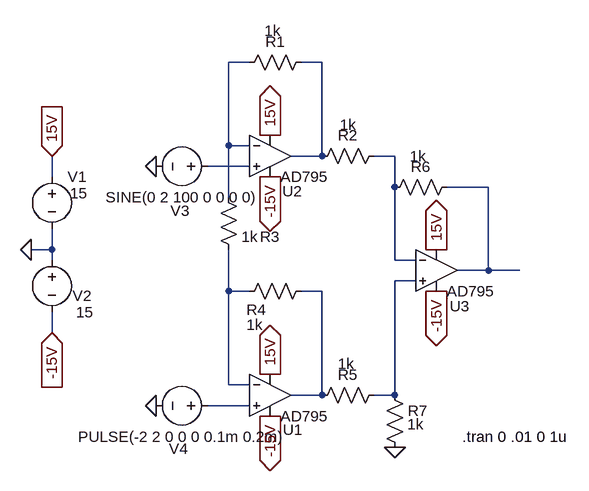
[diagram p0: schematic High Impedance Differential Amplifier.asc]
High Impedance Differential Amplifier.asc, the LTspice schematic file:
Version 4
SHEET 1 2604 1992
WIRE 160 -144 128 -144
WIRE 272 -144 240 -144
WIRE 128 -16 128 -144
WIRE 160 -16 128 -16
WIRE 272 0 272 -144
WIRE 272 0 224 0
WIRE 384 0 352 0
WIRE 160 16 96 16
WIRE -144 32 -144 0
WIRE 384 48 384 0
WIRE 528 48 464 48
WIRE 128 64 128 -16
WIRE -144 144 -144 112
WIRE -144 144 -176 144
WIRE -144 160 -144 144
WIRE 384 160 384 48
WIRE 416 160 384 160
WIRE 528 176 528 48
WIRE 528 176 480 176
WIRE 576 176 528 176
WIRE 416 192 384 192
WIRE 128 208 128 144
WIRE 160 208 128 208
WIRE 272 208 240 208
WIRE -144 272 -144 240
WIRE 128 352 128 208
WIRE 160 352 128 352
WIRE 272 368 272 208
WIRE 272 368 224 368
WIRE 384 368 384 192
WIRE 384 368 352 368
WIRE 160 384 96 384
FLAG -144 272 -15V
IOPIN -144 272 In
FLAG -176 144 0
FLAG -144 0 15V
IOPIN -144 0 In
FLAG 192 336 15V
IOPIN 192 336 Out
FLAG 192 400 -15V
IOPIN 192 400 Out
FLAG 192 -32 15V
IOPIN 192 -32 Out
FLAG 192 32 -15V
IOPIN 192 32 Out
FLAG 448 144 15V
IOPIN 448 144 Out
FLAG 448 208 -15V
IOPIN 448 208 Out
FLAG 384 448 0
FLAG 16 16 0
FLAG 16 384 0
SYMBOL Opamps\\AD795 192 304 R0
WINDOW 0 20 117 Left 2
SYMATTR InstName U1
SYMBOL voltage -144 16 R0
WINDOW 3 28 41 Left 2
WINDOW 123 0 0 Left 2
WINDOW 39 0 0 Left 2
SYMATTR InstName V1
SYMATTR Value 15
SYMBOL voltage -144 144 R0
WINDOW 0 32 71 Left 2
WINDOW 3 37 96 Left 2
WINDOW 123 0 0 Left 2
WINDOW 39 0 0 Left 2
SYMATTR InstName V2
SYMATTR Value 15
SYMBOL res 256 192 R90
WINDOW 0 60 85 VBottom 2
WINDOW 3 52 88 VTop 2
SYMATTR InstName R4
SYMATTR Value 1k
SYMBOL Opamps\\AD795 192 -64 R0
WINDOW 0 19 118 Left 2
SYMATTR InstName U2
SYMBOL res 256 -160 R90
WINDOW 0 0 56 VBottom 2
WINDOW 3 -48 60 VTop 2
SYMATTR InstName R1
SYMATTR Value 1k
SYMBOL res 112 48 R0
WINDOW 0 64 76 Left 2
SYMATTR InstName R3
SYMATTR Value 1k
SYMBOL res 368 -16 R90
WINDOW 0 0 56 VBottom 2
WINDOW 3 -48 56 VTop 2
SYMATTR InstName R2
SYMATTR Value 1k
SYMBOL res 368 352 R90
WINDOW 0 0 56 VBottom 2
WINDOW 3 -48 59 VTop 2
SYMATTR InstName R5
SYMATTR Value 1k
SYMBOL Opamps\\AD795 448 112 R0
WINDOW 0 21 119 Left 2
SYMATTR InstName U3
SYMBOL res 480 32 R90
WINDOW 0 0 56 VBottom 2
WINDOW 3 -47 60 VTop 2
SYMATTR InstName R6
SYMATTR Value 1k
SYMBOL res 368 352 R0
WINDOW 3 35 61 Left 2
SYMATTR InstName R7
SYMATTR Value 1k
SYMBOL voltage 112 16 R90
WINDOW 0 84 59 VBottom 2
WINDOW 3 32 56 VTop 2
WINDOW 123 0 0 Left 2
WINDOW 39 0 0 Left 2
SYMATTR InstName V3
SYMATTR Value SINE(0 2 100 0 0 0 0)
SYMBOL voltage 112 384 R90
WINDOW 0 82 61 VBottom 2
WINDOW 3 32 56 VTop 2
WINDOW 123 0 0 Left 2
WINDOW 39 0 0 Left 2
SYMATTR InstName V4
SYMATTR Value PULSE(-2 2 0 0 0 0.1m 0.2m)
TEXT 488 432 Left 2 !.tran 0 .01 0 1u

The netlist it stands for:
* High Impedance Differential Amplifier.asc
XU1 N009 N007 15V -15V N008 AD795  ; pins In+ In- V+ V- OUT
V1 15V 0 15
V2 0 -15V 15
R4 N008 N007 1k
XU2 N004 N001 15V -15V N002 AD795  ; pins In+ In- V+ V- OUT
R1 N002 N001 1k
R3 N001 N007 1k
R2 N003 N002 1k
R5 N006 N008 1k
XU3 N006 N003 15V -15V N005 AD795  ; pins In+ In- V+ V- OUT
R6 N005 N003 1k
R7 N006 0 1k
V3 N004 0 SINE(0 2 100 0 0 0 0)
V4 N009 0 PULSE(-2 2 0 0 0 0.1m 0.2m)
.tran 0 .01 0 1u
.lib ADI1.lib
.backanno
.end